# Altium schematic sheet Thermistor.SchDoc
size A4
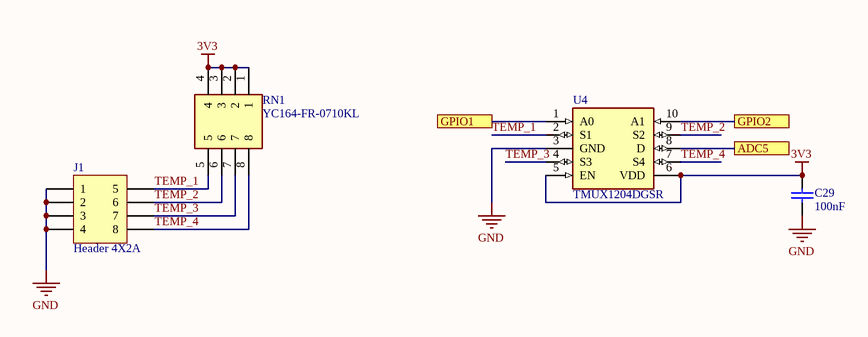
[diagram p0: Thermistor.SchDoc]

## Parts
C29  value 100nF  [C0805]  (hidden comment: 10V)
J1  Header 4X2A  [HDR2X4_CEN]
RN1  YC164-FR-0710KL  [YC164JR07220RL]
U4  TMUX1204DGSR  [SOP50P490X110-10N]

## Ports
ADC5, GPIO1, GPIO2

## Nets
3V3: C29.1 RN1.1 RN1.2 RN1.3 RN1.4 U4.5(EN) U4.6(VDD)
GND: C29.2 J1.1 J1.2 J1.3 J1.4 U4.3(GND)
ADC5: U4.8(D) ; port ADC5
GPIO1: U4.1(A0) ; port GPIO1
GPIO2: U4.10(A1) ; port GPIO2
TEMP_1: J1.5 RN1.5 U4.2(S1)
TEMP_2: J1.6 RN1.6 U4.9(S2)
TEMP_3: J1.7 RN1.7 U4.4(S3)
TEMP_4: J1.8 RN1.8 U4.7(S4)

## Library data of the parts
C29 = Cap: C0805C104K8RACTU. 0.1µF ±10% 10V Ceramic Capacitor X7R 0805 (2012 Metric) /; Published: 8-Jun-2000; LatestRevisionDate: 17-Jul-2002; LatestRevisionNote: Re-released for DXP Platform.; PackageReference: RAD-0.3; Publisher: Altium Limited; PackageDescription: Radial Cap, Thru-Hole; 2 Leads; 0.3 in Pin Spacing
J1 = Header 4X2A: Header, 4-Pin, Dual row; LatestRevisionDate: 17-Jul-2002; LatestRevisionNote: Re-released for DXP Platform.; Publisher: Altium Limited
RN1 = YC164-FR-0710KL: Resistor Network; Manufacturer_Name: YAGEO (PHYCOMP); Datasheet Link: https://www.mouser.com/datasheet/2/447/PYu-YC_TC_group_51_RoHS_L_7-1313905.pdf; Height: 0mm; Manufacturer_Part_Number: YC164-FR-0710KL; Arrow Part Number: YC164-FR-0710KL; Mouser Part Number: 603-YC164-FR-0710KL; Mouser Price/Stock: https://www.mouser.co.uk/ProductDetail/Yageo/YC164-FR-0710KL?qs=8cPjvKtxWv4rLfyjGsoQQw%3D%3D
U4 = TMUX1204DGSR: Integrated Circuit; Manufacturer_Name: Texas Instruments; Datasheet Link: http://www.ti.com/lit/gpn/TMUX1204; Height: 1.1mm; Manufacturer_Part_Number: TMUX1204DGSR; Arrow Part Number: TMUX1204DGSR; Arrow Price/Stock: https://www.arrow.com/en/products/tmux1204dgsr/texas-instruments; Mouser Part Number: 595-TMUX1204DGSR; Mouser Price/Stock: https://www.mouser.co.uk/ProductDetail/Texas-Instruments/TMUX1204DGSR?qs=EBDBlbfErPw42Q0DdvAwUg%3D%3D